# EAGLE schematic BabelBreakout (EAGLE 9.2.2)
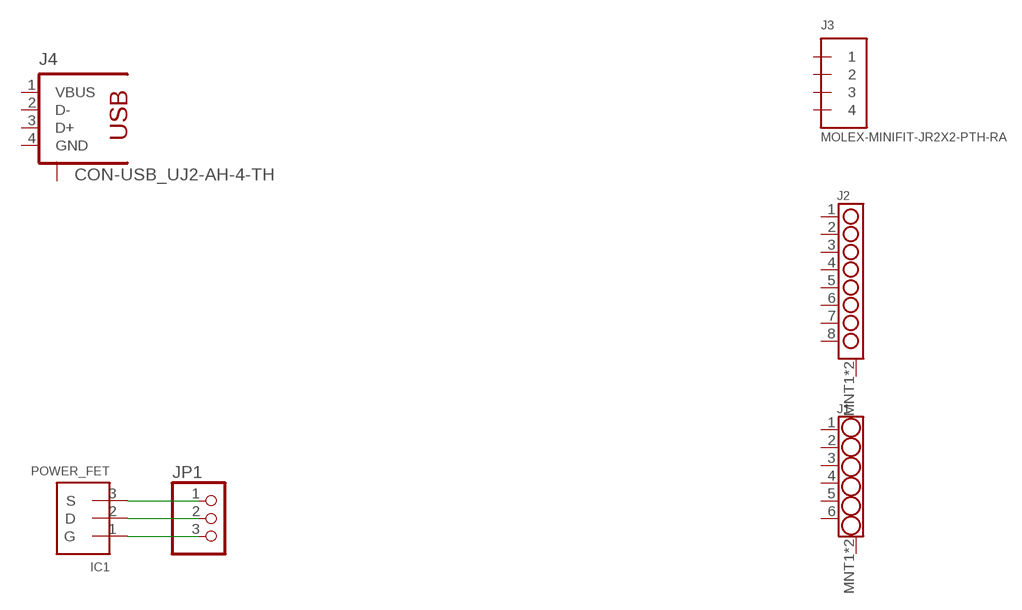
[diagram p0: schematic, sheet 1]

## Parts
IC1  POWER_FET  [POWER_FET]
J1  CON-MOLEX_0532610671  [CON-MOLEX_0532610671]
J2  0532610871  [0532610871]
J3  MOLEX-MINIFIT-JR2X2-PTH-RA  [26-01-3128]
J4  CON-USB_UJ2-AH-4-TH  [CON-USB_UJ2-AH-4-TH]
JP1  PINHD-1X3  [1X03]

## Nets
N$1: IC1.3(S) JP1.1
N$2: IC1.2(D) JP1.2
N$3: IC1.1(G) JP1.3
Unconnected: J1.1 J1.2 J1.3 J1.4 J1.5 J1.6 J1.MNT1(MNT) J1.MNT2(MNT) J2.1 J2.2 J2.3 J2.4 J2.5 J2.6 J2.7 J2.8 J2.MNT1(MNT) J2.MNT2(MNT) J3.1 J3.2 J3.3 J3.4 J4.1(VBUS) J4.2(D-) J4.3(D+) J4.4(GND) J4.M1(S) J4.M2(S)

## Library data of the parts
IC1 = VanEagleLib:POWER_FET: Generic footprint for power FET, such as the IRLB8721, IRFZ544, IRF540, etc. Small footprint, meant for vertical installation of through-hole TO-220 FET, minimizing board space.
J1 = VanEagleLib:CON-MOLEX_0532610671: Molex: 6 pin 1.25mm Right Angle SMD connector; DIGIKEY: WM7624CT-ND; MFR: Molex; MPN: 0532610671
J2 = VCO-Eagle_parts:0532610871: CONN HEADER 8POS 1.25MM R/A SMD; DIGIKEY: WM7626CT-ND; MFR: Molex; MPN: 0532610871
J3 = VCO-Eagle_parts:MOLEX-MINIFIT-JR
J4 = VCO_PodController_Part_17004_v2:CON-USB_UJ2-AH-4-TH: USB Receptacle 2.0 TYPE A 4P; DIGIKEY: 102-3994-ND; MFR: CUI; MPN: UJ2-AH-4-TH
JP1 = adafruit:PINHD-1X3: PIN HEADER